# Altium project Volga-PCB.PrjPcb
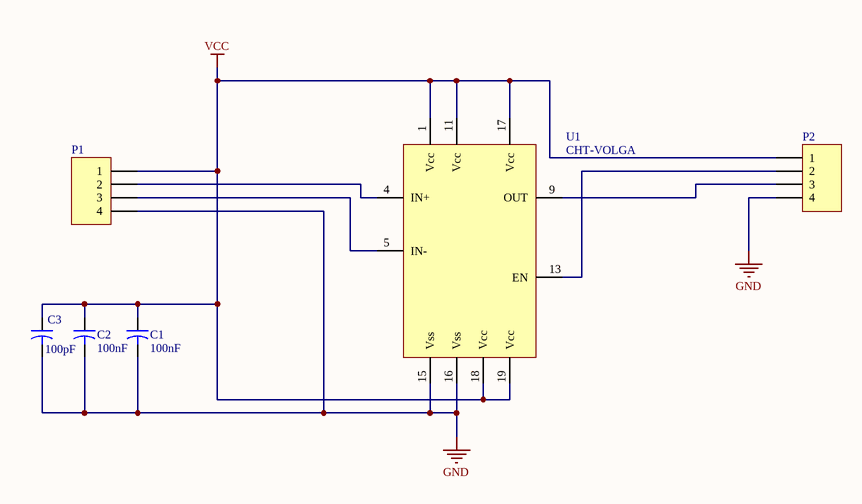
[diagram p0: Volga-PCB.SchDoc]
1 sheet, 6 parts. Net scope: global (net labels, ports and power ports of the same name join across sheets).
Board file: Volga-PCB.PcbDoc

## Sheet Volga-PCB.SchDoc: Volga PCB
size A4; Revision: 1; SheetNumber: 1; SheetTotal: 1; PartNumber: PN0053; Drawn By: Sebastian kulik; ProjectName: Volga PCB

### Parts
C1  value 100nF  [Dummy-10mm]  (hidden comment: Capacitor-Dummy-THT)
C2  value 100nF  [Dummy-10mm]  (hidden comment: Capacitor-Dummy-THT)
C3  value 100pF  [Dummy-10mm]  (hidden comment: Capacitor-Dummy-THT)
P1  Plug_4_90_2.54  [HDR1X4]  (value not drawn)
P2  Plug_4_90_2.54  [HDR1X4]  (value not drawn)
U1  CHT-VOLGA  [TDFP16]

### Nets
GND: C1.2 C2.2 C3.2 P1.4 P2.4 U1.15(Vss) U1.16(Vss)
VCC: C1.1 C2.1 C3.1 P1.1 P2.1 U1.1(Vcc) U1.11(Vcc) U1.17(Vcc) U1.18(Vcc) U1.19(Vcc)
NetP1_2: P1.2 U1.4(IN+)
NetP1_3: P1.3 U1.5(IN-)
NetP2_2: P2.2 U1.13(EN)
NetP2_3: P2.3 U1.9(OUT)

### Notes on the sheet
- Title
- Date
- Part Number
- Revision
- Sheet
- of
- Drawn By
- File

### Library data of the parts
C1 C2 = Capacitor-Dummy-THT: Deliverer PartNr: 721-5240; Deliverer: RS; Published: 08.12.2015; Part Description: Capacitor-Dummy-THT; Publisher: Sebastian Kulik; PackageDescription: -; Manufacturer: -; Manufacturer PartNr: -; TDE-PN: -; Price: 0.081/50
C3 = Capacitor-Dummy-THT: Deliverer PartNr: 117-344; Deliverer: RS; Published: 08.12.2015; Part Description: Capacitor-Dummy-THT; Publisher: Sebastian Kulik; PackageDescription: -; Manufacturer: -; Manufacturer PartNr: -; TDE-PN: -; Price: 0.09/10
P1 P2 = Plug_4_90_2.54: Plug, 4-Pin; Manufacturer PartNr: 613 004 111 21; Manufacturer: WE; TDE-PN: CON0033; LatestRevisionDate: 06.11.2014; LatestRevisionNote: Re-released for DXP Platform.; Publisher: Sebastian Kulik; Deliverer: WE; Deliverer PartNr: 613 004 111 21
U1 = CHT-VOLGA: Comparator, Hi-Temp, 25MHz; Deliverer: CISSOID; TDE-PN: IC0080; Published: 01.08.2016; Deliverer PartNr: CHT-VOLGA; PackageDescription: DIP16; Publisher: Sebastian Kulik; Manufacturer PartNr: CHT-VOLGA; Manufacturer: CISSOID; Price: 204.93/5